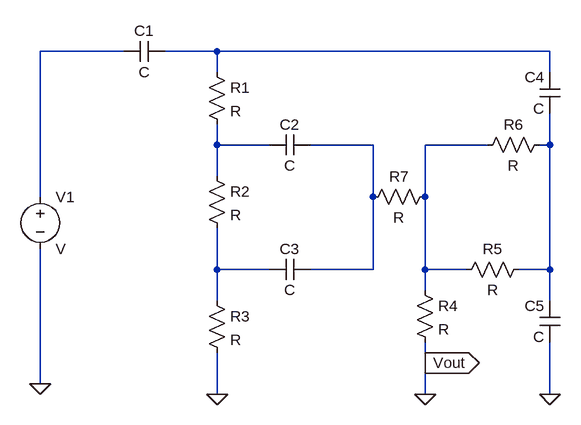
[diagram p0: schematic baxandall_eq.asc]
baxandall_eq.asc, the LTspice schematic file:
Version 4
SHEET 1 880 680
WIRE 48 80 -80 80
WIRE 192 80 112 80
WIRE 704 80 192 80
WIRE 192 112 192 80
WIRE 704 112 704 80
WIRE 192 224 192 192
WIRE 272 224 192 224
WIRE 432 224 336 224
WIRE 608 224 512 224
WIRE 704 224 704 176
WIRE 704 224 688 224
WIRE 192 272 192 224
WIRE -80 304 -80 80
WIRE 432 304 432 224
WIRE 512 304 512 224
WIRE 192 416 192 352
WIRE 272 416 192 416
WIRE 432 416 432 304
WIRE 432 416 336 416
WIRE 512 416 512 304
WIRE 576 416 512 416
WIRE 704 416 704 224
WIRE 704 416 656 416
WIRE 512 448 512 416
WIRE 192 464 192 416
WIRE 704 464 704 416
WIRE 512 560 512 528
WIRE -80 592 -80 384
WIRE 192 608 192 544
WIRE 512 608 512 560
WIRE 704 608 704 528
FLAG 192 608 0
FLAG 512 608 0
FLAG 704 608 0
FLAG -80 592 0
FLAG 512 560 Vout
IOPIN 512 560 Out
SYMBOL voltage -80 288 R0
SYMATTR InstName V1
SYMBOL cap 112 64 R90
WINDOW 0 0 32 VBottom 2
WINDOW 3 32 32 VTop 2
SYMATTR InstName C1
SYMBOL cap 272 240 R270
WINDOW 0 32 32 VTop 2
WINDOW 3 0 32 VBottom 2
SYMATTR InstName C2
SYMBOL cap 272 432 R270
WINDOW 0 32 32 VTop 2
WINDOW 3 0 32 VBottom 2
SYMATTR InstName C3
SYMBOL cap 720 176 R180
WINDOW 0 24 56 Left 2
WINDOW 3 24 8 Left 2
SYMATTR InstName C4
SYMBOL cap 720 528 R180
WINDOW 0 24 56 Left 2
WINDOW 3 24 8 Left 2
SYMATTR InstName C5
SYMBOL res 176 96 R0
SYMATTR InstName R1
SYMBOL res 176 256 R0
SYMATTR InstName R2
SYMBOL res 176 448 R0
SYMATTR InstName R3
SYMBOL res 496 432 R0
SYMATTR InstName R4
SYMBOL res 672 400 R90
WINDOW 0 0 56 VBottom 2
WINDOW 3 32 56 VTop 2
SYMATTR InstName R5
SYMBOL res 704 208 R90
WINDOW 0 0 56 VBottom 2
WINDOW 3 32 56 VTop 2
SYMATTR InstName R6
SYMBOL res 528 288 R90
WINDOW 0 0 56 VBottom 2
WINDOW 3 32 56 VTop 2
SYMATTR InstName R7

The netlist it stands for:
* baxandall_eq.asc
V1 N001 0 V
C1 N002 N001 C
C2 N003 N004 C
C3 N007 N004 C
C4 N006 N002 C
C5 0 N006 C
R1 N002 N003 R
R2 N003 N007 R
R3 N007 0 R
R4 N005 0 R
R5 N006 N005 R
R6 N006 N005 R
R7 N005 N004 R
.backanno
.end